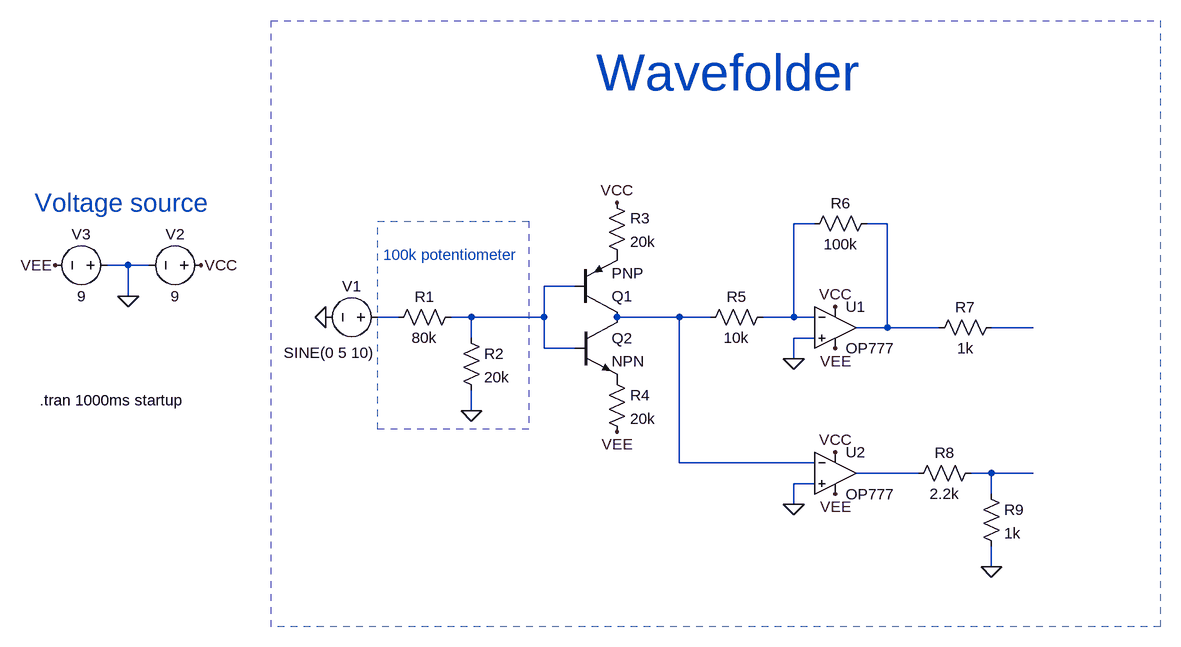
[diagram p0: schematic wavefolder.asc]
wavefolder.asc, the LTspice schematic file:
Version 4
SHEET 1 1272 680
WIRE 736 -48 704 -48
WIRE 848 -48 816 -48
WIRE -320 16 -352 16
WIRE -288 16 -320 16
WIRE 368 48 320 48
WIRE -320 64 -320 16
WIRE 96 96 64 96
WIRE 208 96 176 96
WIRE 320 96 320 48
WIRE 320 96 208 96
WIRE 528 96 432 96
WIRE 576 96 528 96
WIRE 704 96 704 -48
WIRE 704 96 656 96
WIRE 736 96 704 96
WIRE 848 112 848 -48
WIRE 848 112 800 112
WIRE 928 112 848 112
WIRE 1072 112 1008 112
WIRE 208 128 208 96
WIRE 736 128 704 128
WIRE 320 144 320 96
WIRE 368 144 320 144
WIRE 704 160 704 128
WIRE 208 240 208 208
WIRE 528 320 528 96
WIRE 736 320 528 320
WIRE 896 336 800 336
WIRE 1008 336 976 336
WIRE 1072 336 1008 336
WIRE 736 352 704 352
WIRE 1008 368 1008 336
WIRE 704 384 704 352
WIRE 1008 480 1008 448
FLAG 208 240 0
FLAG 432 -80 VCC
FLAG 432 272 VEE
FLAG 768 80 VCC
FLAG 768 144 VEE
FLAG 704 160 0
FLAG 768 304 VCC
FLAG 768 368 VEE
FLAG 704 384 0
FLAG 1008 480 0
FLAG -16 96 0
FLAG -432 16 VEE
FLAG -208 16 VCC
FLAG -320 64 0
SYMBOL res 192 80 R90
WINDOW 0 0 56 VBottom 2
WINDOW 3 32 56 VTop 2
SYMATTR InstName R1
SYMATTR Value 80k
SYMBOL res 192 112 R0
SYMATTR InstName R2
SYMATTR Value 20k
SYMBOL pnp 368 96 M180
SYMATTR InstName Q1
SYMBOL npn 368 96 R0
SYMATTR InstName Q2
SYMBOL res 416 -96 R0
SYMATTR InstName R3
SYMATTR Value 20k
SYMBOL res 416 176 R0
SYMATTR InstName R4
SYMATTR Value 20k
SYMBOL res 672 80 R90
WINDOW 0 0 56 VBottom 2
WINDOW 3 32 56 VTop 2
SYMATTR InstName R5
SYMATTR Value 10k
SYMBOL res 832 -64 R90
WINDOW 0 0 56 VBottom 2
WINDOW 3 32 56 VTop 2
SYMATTR InstName R6
SYMATTR Value 100k
SYMBOL OpAmps/OP777 768 48 R0
SYMATTR InstName U1
SYMBOL res 1024 96 R90
WINDOW 0 0 56 VBottom 2
WINDOW 3 32 56 VTop 2
SYMATTR InstName R7
SYMATTR Value 1k
SYMBOL OpAmps/OP777 768 272 R0
SYMATTR InstName U2
SYMBOL res 992 320 R90
WINDOW 0 0 56 VBottom 2
WINDOW 3 32 56 VTop 2
SYMATTR InstName R8
SYMATTR Value 2.2k
SYMBOL res 992 352 R0
SYMATTR InstName R9
SYMATTR Value 1k
SYMBOL voltage 80 96 R90
WINDOW 0 -32 56 VBottom 2
WINDOW 3 39 91 VTop 2
WINDOW 123 0 0 Left 0
WINDOW 39 0 0 Left 0
SYMATTR InstName V1
SYMATTR Value SINE(0 5 10)
SYMBOL voltage -192 16 R90
WINDOW 0 -32 56 VBottom 2
WINDOW 3 32 56 VTop 2
SYMATTR InstName V2
SYMATTR Value 9
SYMBOL voltage -336 16 R90
WINDOW 0 -32 56 VBottom 2
WINDOW 3 32 56 VTop 2
SYMATTR InstName V3
SYMATTR Value 9
TEXT 400 -280 Left 6 ;Wavefolder
TEXT -456 224 Left 2 !.tran 1000ms startup
TEXT -464 -80 Left 4 ;Voltage source
TEXT 72 0 Left 2 ;100k potentiometer
RECTANGLE Normal -100 -360 1268 572 2
RECTANGLE Normal 64 -52 296 268 2

The netlist it stands for:
* wavefolder.asc
R1 N003 N004 80k
R2 N003 0 20k
Q1 N005 N003 P001 0 PNP
Q2 N005 N003 P002 0 NPN
R3 VCC P001 20k
R4 P002 VEE 20k
R5 N001 N005 10k
R6 N002 N001 100k
XU1 0 N001 VCC VEE N002 OP777  ; pins In+ In- V+ V- OUT
R7 N006 N002 1k
XU2 0 N005 VCC VEE N007 OP777  ; pins In+ In- V+ V- OUT
R8 N008 N007 2.2k
R9 N008 0 1k
V1 N004 0 SINE(0 5 10)
V2 VCC 0 9
V3 0 VEE 9
.model NPN NPN
.model PNP PNP
.lib standard.bjt
* Wavefolder
.tran 1000ms startup
* Voltage source
* 100k potentiometer
.lib ADI.lib
.backanno
.end